# Altium schematic sheet MainBoard.SchDoc
size A3
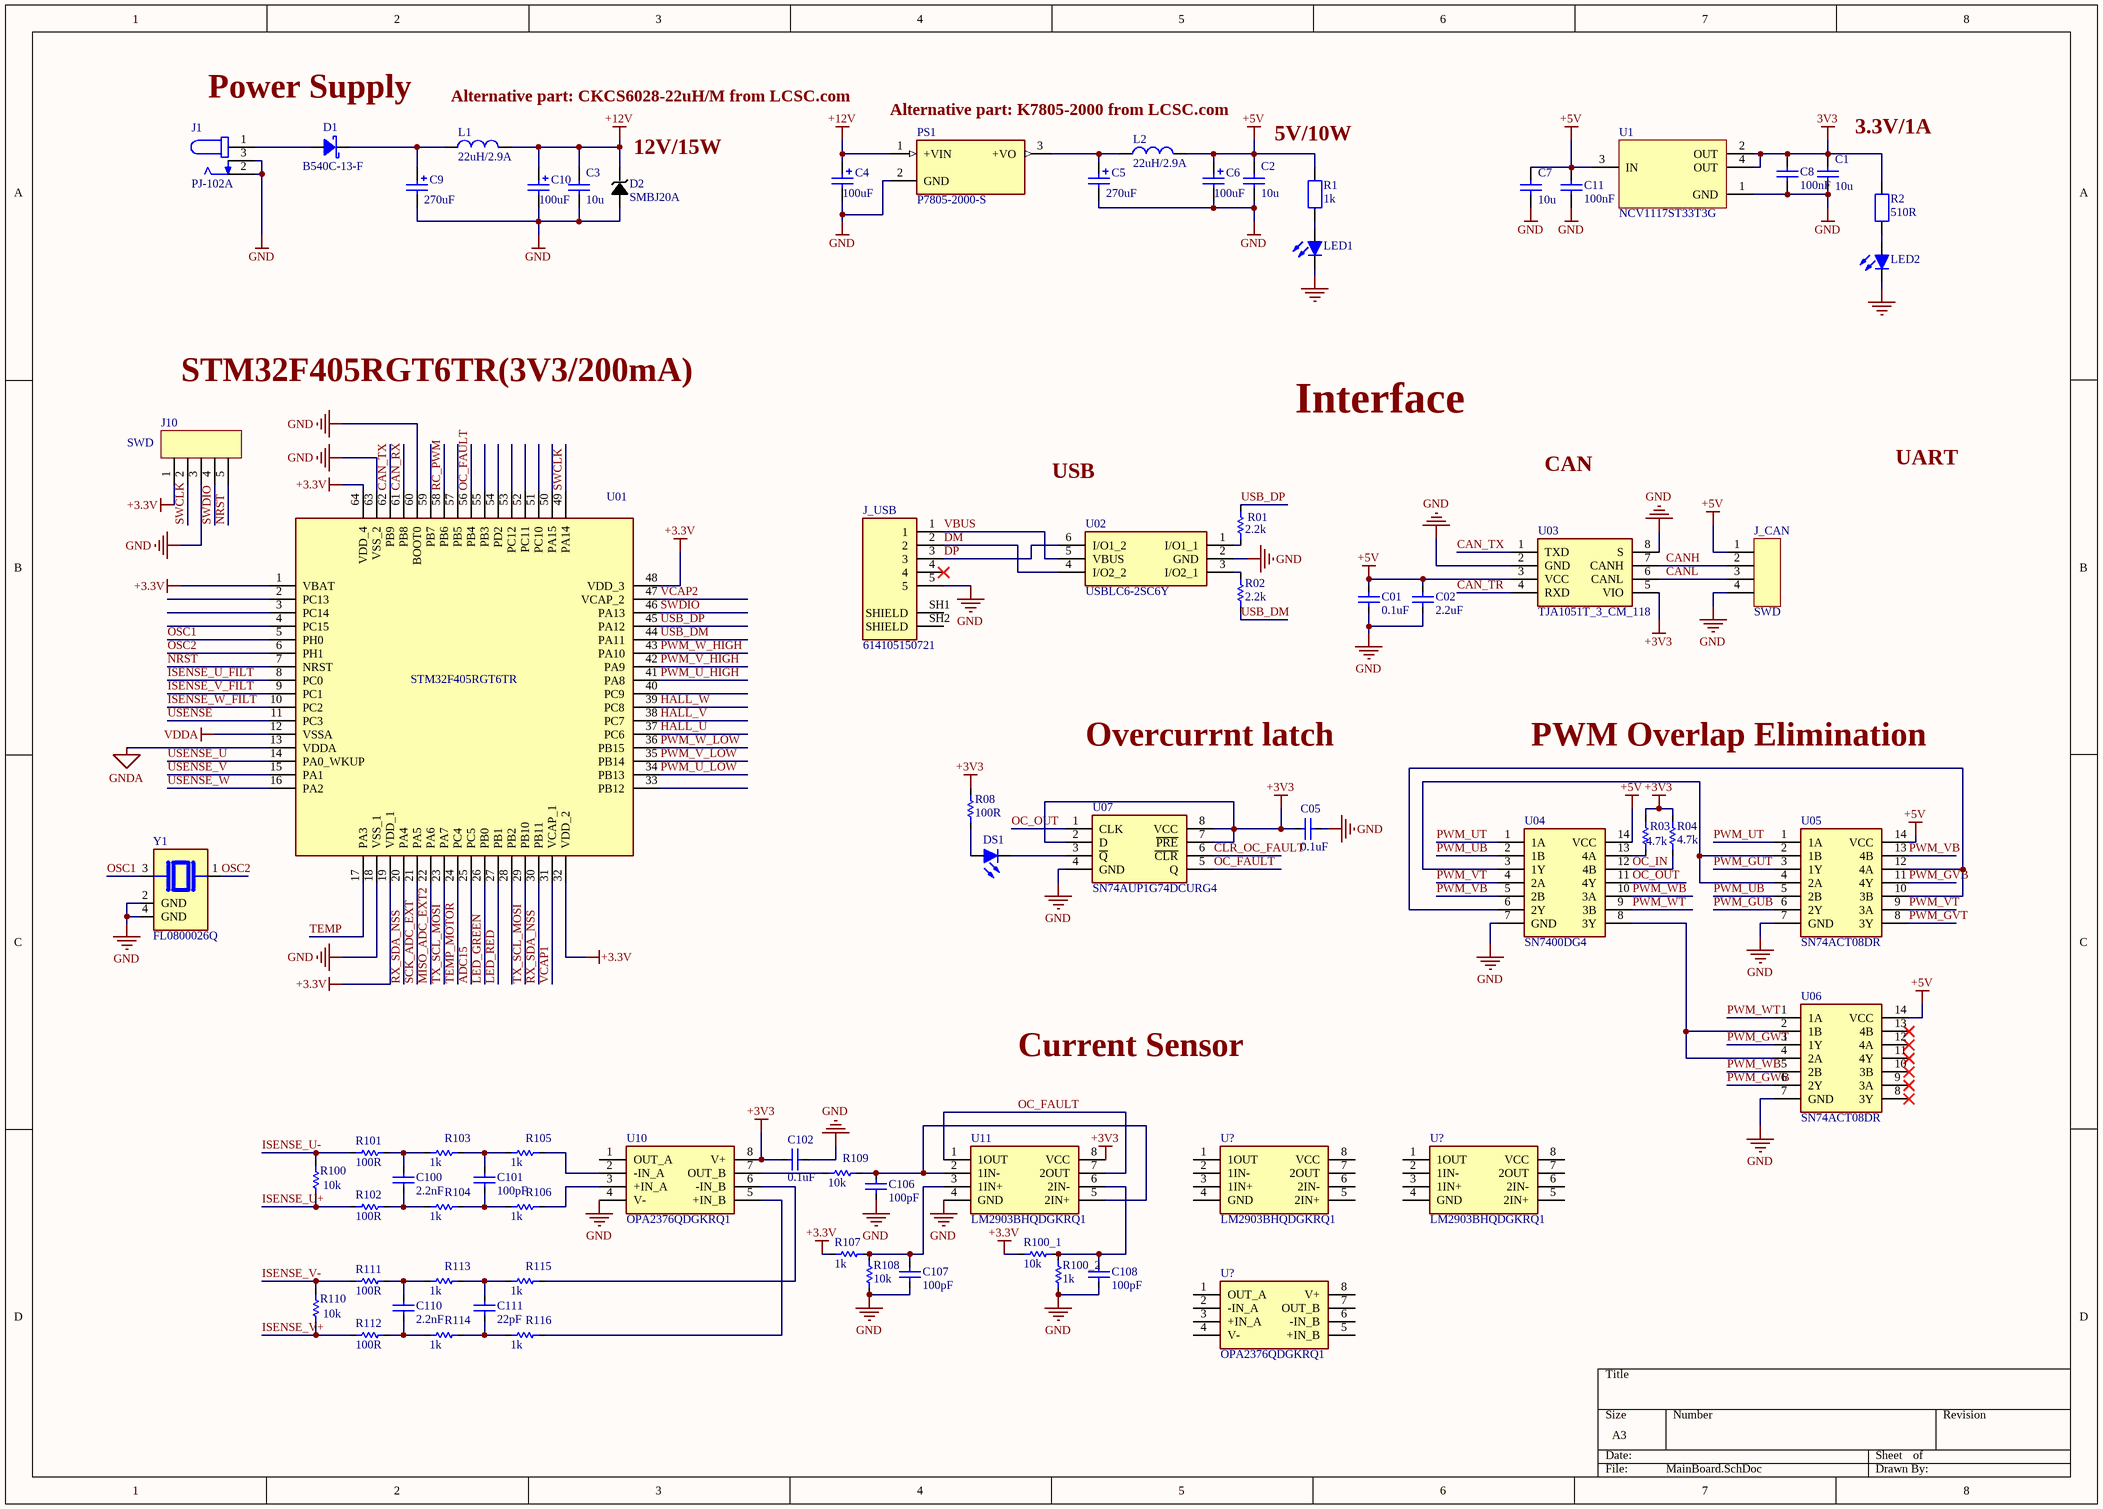
[diagram p0: MainBoard.SchDoc]

## Parts
(Parts that share a designator on the sheet are numbered #1, #2 ... from top to bottom, then left to right.)
C1  10u  [C1206]
C01  0.1uF  [SMD_C(0402)]
C2  10u  [C1206]
C02  2.2uF  [SMD_C(0603)]
C3  10u  [C1206]
C4  100uF  [CAP_EEUFC1E101S]
C5  270uF  [CAP_EEU-FK1E271B]
C05  0.1uF  [SMD_C(0402)]
C6  100uF  [CAP_EEUFC1E101S]
C7  10u  [C1206]
C8  100nF  [C0603]
C9  270uF  [CAP_EEU-FK1E271B]
C10  100uF  [CAP_EEUFC1E101S]
C11  100nF  [C0603]
C100  2.2nF  [SMD_C(0402)]
C101  100pF  [SMD_C(0402)]
C102  0.1uF  [SMD_C(0402)]
C106  100pF  [SMD_C(0402)]
C107  100pF  [SMD_C(0402)]
C108  100pF  [SMD_C(0402)]
C110  2.2nF  [SMD_C(0402)]
C111  22pF  [SMD_C(0402)]
D1  B540C-13-F  [DO-214AB2]
D2  SMBJ20A  [DO-214AA2]
DS1  SML-D12U1WT86  [LED0603]  (value not drawn)
J1  PJ-102A  [CUI_PJ-102A]
J10  SWD  [Header-2.54m-5pin]
J_CAN  SWD  [Header-2.54m-4pin]
J_USB  614105150721  [WURTH_614105150721]
L1  22uH/2.9A  [IND_SRP6030]
L2  22uH/2.9A  [IND_SRP6030]
LED1  SML-D12U1WT86  [LED0603]  (value not drawn)
LED2  SML-D12U1WT86  [LED0603]  (value not drawn)
PS1  P7805-2000-S  [CONV_P7805-2000-S]
R1  1k  [R0603]
R01  2.2k  [SMD_R(0402)]
R2  510R  [R0603]
R02  2.2k  [SMD_R(0402)]
R03  4.7k  [SMD_R(0402)]
R04  4.7k  [SMD_R(0402)]
R08  100R  [SMD_R(0402)]
R100  10k  [SMD_R(0402)]
R100_1  10k  [SMD_R(0402)]
R100_2  1k  [SMD_R(0402)]
R101  100R  [SMD_R(0402)]
R102  100R  [SMD_R(0402)]
R103  1k  [SMD_R(0402)]
R104  1k  [SMD_R(0402)]
R105  1k  [SMD_R(0402)]
R106  1k  [SMD_R(0402)]
R107  1k  [SMD_R(0402)]
R108  10k  [SMD_R(0402)]
R109  10k  [SMD_R(0402)]
R110  10k  [SMD_R(0402)]
R111  100R  [SMD_R(0402)]
R112  100R  [SMD_R(0402)]
R113  1k  [SMD_R(0402)]
R114  1k  [SMD_R(0402)]
R115  1k  [SMD_R(0402)]
R116  1k  [SMD_R(0402)]
U1  NCV1117ST33T3G  [SOT223-3]
U01  STM32F405RGT6TR  [QFP50P1200X1200X160-64N]
U02  USBLC6-2SC6Y  [SOT95P280X145-6N]
U03  TJA1051T_3_CM_118  [SOIC127P600X175-8N]
U04  SN7400DG4  [SOIC127P600X175-14N]
U05  SN74ACT08DR  [SOIC127P600X175-14N]
U06  SN74ACT08DR  [SOIC127P600X175-14N]
U07  SN74AUP1G74DCURG4  [SOP50P310X90-8N]
U10  OPA2376QDGKRQ1  [SOP65P490X110-8N]
U11  LM2903BHQDGKRQ1  [SOP65P490X110-8N]
U?#1  LM2903BHQDGKRQ1  [SOP65P490X110-8N]
U?#2  LM2903BHQDGKRQ1  [SOP65P490X110-8N]
U?#3  OPA2376QDGKRQ1  [SOP65P490X110-8N]
Y1  FL0800026Q  [XTAL_FL0800026Q]

## Nets
3V3: C1.2 C8.2 R2.2 U1.2(OUT) U1.4(OUT)
+3.3V: J10.1 R100_1.1 R107.1 U01.1(VBAT) U01.19(VDD_1) U01.32(VDD_2) U01.48(VDD_3) U01.64(VDD_4)
+3V3: C05.2 C102.1 R03.2 R04.2 R08.2 U03.5(VIO) U07.2(D) U07.7(~{PRE}) U07.8(VCC) U10.8(V+) U11.8(VCC)
+5V: C01.2 C2.2 C02.2 C6.1 C7.2 C11.2 J_CAN.1 L2.2 R1.2 U1.3(IN) U03.3(VCC) U04.14(VCC) U05.14(VCC) U06.14(VCC)
+12V: C3.2 C4.1 C10.1 D2.C L1.2 PS1.1(+VIN)
GND: C1.1 C01.1 C2.1 C02.1 C3.1 C4.2 C05.1 C5.2 C6.2 C7.1 C8.1 C9.2 C10.2 C11.1 C102.2 C106.1 C107.1 C108.1 D2.A J1.2 J1.3 J10.3 J_CAN.4 J_USB.5 LED1.C LED2.C PS1.2(GND) R100_2.2 R108.2 U1.1(GND) U01.18(VSS_1) U01.60(BOOT0) U01.63(VSS_2) U02.2(GND) U03.2(GND) U03.8(S) U04.7(GND) U05.7(GND) U06.7(GND) U07.4(GND) U10.4(V-) U11.4(GND) Y1.2(GND) Y1.4(GND)
GNDA: U01.13(VDDA)
VDDA: U01.12(VSSA)
ADC15: U01.25(PC5)
CAN_RX: U01.61(PB8)
CAN_TR: U03.4(RXD)
CAN_TX: U01.62(PB9) U03.1(TXD)
CANH: J_CAN.2 U03.7(CANH)
CANL: J_CAN.3 U03.6(CANL)
CLR_OC_FAULT: U07.6(~{CLR})
DM: J_USB.2 U02.4(I/O2_2)
DP: J_USB.3 U02.6(I/O1_2)
HALL_U: U01.37(PC6)
HALL_V: U01.38(PC7)
HALL_W: U01.39(PC8)
ISENSE_U+: R100.2 R102.2
ISENSE_U-: R100.1 R101.2
ISENSE_U_FILT: U01.8(PC0)
ISENSE_V+: R110.2 R112.2
ISENSE_V-: R110.1 R111.2
ISENSE_V_FILT: U01.9(PC1)
ISENSE_W_FILT: U01.10(PC2)
LED_GREEN: U01.26(PB0)
LED_RED: U01.27(PB1)
MISO_ADC_EXT2: U01.22(PA6)
NRST: J10.5 U01.7(NRST)
OC_FAULT: U01.56(PB4) U07.5(Q) U11.1(1OUT) U11.7(2OUT)
OC_IN: R04.1 U04.12(4B)
OC_OUT: U04.11(4Y) U07.1(CLK)
OSC1: U01.5(PH0) Y1.3
OSC2: U01.6(PH1) Y1.1
PWM_GUB: U05.6(2Y)
PWM_GUT: U05.3(1Y)
PWM_GVB: U05.11(4Y)
PWM_GVT: U05.8(3Y)
PWM_GWB: U06.6(2Y)
PWM_GWT: U06.3(1Y)
PWM_U_HIGH: U01.41(PA8)
PWM_U_LOW: U01.34(PB13)
PWM_UB: U04.2(1B) U05.5(2B)
PWM_UT: U04.1(1A) U05.1(1A)
PWM_V_HIGH: U01.42(PA9)
PWM_V_LOW: U01.35(PB14)
PWM_VB: U04.5(2B) U05.13(4B)
PWM_VT: U04.4(2A) U05.9(3A)
PWM_W_HIGH: U01.43(PA10)
PWM_W_LOW: U01.36(PB15)
PWM_WB: U04.10(3A) U06.5(2B)
PWM_WT: U04.9(3B) U06.1(1A)
RC_PWM: U01.58(PB6)
RX_SDA_NSS: U01.20(PA4) U01.30(PB11)
SCK_ADC_EXT: U01.21(PA5)
SWCLK: J10.2 U01.49(PA14)
SWDIO: J10.4 U01.46(PA13)
TEMP: U01.17(PA3)
TEMP_MOTOR: U01.24(PC4)
TX_SCL_MOSI: U01.23(PA7) U01.29(PB10)
USB_DM: R02.2 U01.44(PA11)
USB_DP: R01.2 U01.45(PA12)
USENSE: U01.11(PC3)
USENSE_U: U01.14(PA0_WKUP)
USENSE_V: U01.15(PA1)
USENSE_W: U01.16(PA2)
VBUS: J_USB.1 U02.5(VBUS)
VCAP1: U01.31(VCAP_1)
VCAP2: U01.47(VCAP_2)
NetC5_1: C5.1 L2.1 PS1.3(+VO)
NetC9_1: C9.1 D1.C L1.1
NetC100_1: C100.1 R102.1 R104.2
NetC100_2: C100.2 R101.1 R103.2
NetC101_1: C101.1 R104.1 R106.2
NetC101_2: C101.2 R103.1 R105.2
NetC106_2: C106.2 R109.1 U11.2(1IN-) U11.5(2IN+)
NetC107_2: C107.2 R107.2 R108.1 U11.3(1IN+)
NetC108_2: C108.2 R100_1.2 R100_2.1 U11.6(2IN-)
NetC110_1: C110.1 R112.1 R114.2
NetC110_2: C110.2 R111.1 R113.2
NetC111_1: C111.1 R114.1 R116.2
NetC111_2: C111.2 R113.1 R115.2
NetD1_A: D1.A J1.1
NetDS1_A: DS1.A R08.1
NetDS1_C: DS1.C U07.3(~{Q})
NetLED1_A: LED1.A R1.1
NetLED2_A: LED2.A R2.1
NetR01_1: R01.1 U02.1(I/O1_1)
NetR02_1: R02.1 U02.3(I/O2_1)
NetR03_1: R03.1 U04.13(4A)
NetR105_1: R105.1 U10.2(-IN_A)
NetR106_1: R106.1 U10.3(+IN_A)
NetR109_2: R109.2 U10.7(OUT_B)
NetR115_1: R115.1 U10.6(-IN_B)
NetR116_1: R116.1 U10.5(+IN_B)
NetU04_3: U04.3(1Y) U05.2(1B) U05.4(2A)
NetU04_6: U04.6(2Y) U05.10(3B) U05.12(4A)
NetU04_8: U04.8(3Y) U06.2(1B) U06.4(2A)

Not connected (* = marked no-connect by the designer): J_USB 4* SH1(SHIELD) SH2(SHIELD); U01 2(PC13) 3(PC14) 4(PC15) 28(PB2) 33(PB12) 40(PC9) 50(PA15) 51(PC10) 52(PC11) 53(PC12) 54(PD2) 55(PB3) 57(PB5) 59(PB7); U06 8(3Y)* 9(3A)* 10(3B)* 11(4Y)* 12(4A)* 13(4B)*; U10 1(OUT_A); U?#1 1(1OUT) 2(1IN-) 3(1IN+) 4(GND) 5(2IN+) 6(2IN-) 7(2OUT) 8(VCC); U?#2 1(1OUT) 2(1IN-) 3(1IN+) 4(GND) 5(2IN+) 6(2IN-) 7(2OUT) 8(VCC); U?#3 1(OUT_A) 2(-IN_A) 3(+IN_A) 4(V-) 5(+IN_B) 6(-IN_B) 7(OUT_B) 8(V+)

## Notes on the sheet
- Power Supply
- (near L1) Alternative part: CKCS6028-22uH/M from LCSC.com
- (near D2) 12V/15W
- Alternative part: K7805-2000 from LCSC.com
- 5V/10W
- 3.3V/1A
- STM32F405RGT6TR(3V3/200mA)
- Interface
- USB
- CAN
- UART
- Overcurrnt latch
- PWM Overlap Elimination
- Current Sensor

## Library data of the parts
C1-C3 C7 = 10uF ± 10% 25V: Manufacturer: Yageo; Manufacturer Part Number: CC1206KKX7R8BB106; Tolerance: +-10%; Type: X7R; Voltage (V): 25; Category: Capacitor; Value: 10u; Price: 0.44; Supplier: Mouser; Supplier Part Number: 603-CC126KKX7R8BB106
C01 C05 C102 = Cap_1: Multilayer Ceramic Capacitors MLCC - SMD/SMT 50 V 0.1uF X7R 0603 10%; Manufacturer: Yageo; Manufacturer Part Number: CC0603KPX7R9BB104; Supplier 1: Digi-Key; Supplier Part Number 1: 311-3567-1-ND
C02 = Cap_4: Multilayer Ceramic Capacitors MLCC - SMD/SMT 2.2 uF 50 VDC 10% 1206 X7R AEC-Q200; Manufacturer: Yageo; Manufacturer Part Number: GCM31CR71H225KA55K; Supplier 1: Digi-Key; Supplier Part Number 1: 311-3567-1-ND
C4 C6 C10 = EEU-FC1E101S: CAP ALUM 100UF 20% 25V SMD; Manufacturer: Panasonic; Manufacturer Part Number: EEU-FC1E101S; Value: 100uF; Supplier: Mouser; Supplier Part Number: 667-EEU-FC1E101S; Price: 0.4
C5 C9 = EEU-FC1E271B: CAP ALUM 270UF 20% 25V SMD; Manufacturer: Panasonic; Manufacturer Part Number: EEU-FC1E271B; Value: 270uF; Supplier: Mouser; Supplier Part Number: 667-EEU-FC1E271B; Price: 0.7
C8 C11 = 100nF ± 10% 50V: Manufacturer: Yageo; Manufacturer Part Number: CC0603KRX7R9BB104; Value: 100nF; Supplier: Mouser; Supplier Part Number: 603-CC603KRX7R9BB104; Price: 0.1
C100 C101 C106-C108 C110 C111 = Cap_7: PHE840MA6100MA04R17; Manufacturer: Yageo; Manufacturer Part Number: CC0603KPX7R9BB104; Supplier 1: Digi-Key; Supplier Part Number 1: 311-3567-1-ND
D1 = B540C-13-F: Schottky Diodes & Rectifiers 40V 5A; Value: B540C-13-F; Manufacturer Part Number: B540C-13-F; Manufacturer: Diodes; Supplier: Mouser; Supplier Part Number: 621-B540C-F; Price: 0.5
D2 = ZM4746A-GS08: ESD Suppressors / TVS Diodes 600W, 23.4V, 5%, Unidirectional, TVS; Manufacturer: Littelfuse; Value: SMBJ20A; Manufacturer Part Number: SMBJ20A; Supplier: Mouser; Supplier Part Number: 576-SMBJ20A; Price: 0.35
DS1 LED1 LED2 = SML-D12U1WT86: Typical RED GaAs LED; Manufacturer: Rohm Semiconductor; Supplier: Mouser; Supplier Part Number: 755-SML-D12U1WT86; Manufacturer Part Number: SML-D12U1WT86; Value: SML-D12U1WT86; Price: 0.2
J1 = PJ-102A: CONN PWR JACK 2X5.5MM SOLDER; Manufacturer: CUI Devices; Manufacturer Part Number: PJ-102A; Value: PJ-102A; Supplier: Mouser; Supplier Part Number: 490-PJ-102A; Price: 0.8
J10 = 5PinConnector
J_CAN = 4PinConnector
J_USB = 614105150721: USB - micro B USB 2.0 Receptacle Connector 5 Position Through Hole; MF: Wurth Electronics; Package: None; Digi-Key_Part_Number: 732-5958-1-ND; MP: 614105150721; SnapEDA_Link: https://www.snapeda.com/parts/614105150721/Wurth%20Electronics%20Inc./view-part/1118291/?ref=snap; Value: *; Digi-Key_Purchase_URL: https://www.digikey.com/product-detail/en/w-rth-elektronik/614105150721/732-5958-1-ND/5047553?utm_source=snapeda&utm_medium=aggregator&utm_campaign=symbol
L1 L2 = SRP6030WA-220M: Power Inductors - SMD Ind,7.1x6.6x2.8mm,22uH+/-20%,2.9A,shd; Manufacturer: Bourns; Manufacturer Part Number: SRP6030WA-220M; Value: 22uH/2.9A; Supplier: Mouser; Supplier Part Number: 652-SRP6030WA-220M; Price: 1.2
PS1 = P7805-2000-S: 2 A Output Current, 6~36 Vdc Input, SIP, Non-Isolated, Dc-Dc Converter; Manufacturer: CUI Inc.; Price: 6.5; Supplier: Mouser; Value: P7805-2000-S; Supplier Part Number: 490-P7805-2000-S; Manufacturer Part Number: P7805-2000-S
R1 = 1 kOhms ±1% 0.1W: Manufacturer: Yageo; Manufacturer Part Number: RC0603FR-071KL; Value: 1k; Supplier: Mouser; Supplier Part Number: 603-RC0603FR-071KL; Price: 0.1
R01 R02 = Res Semi_2: CRCW04024R02FKED; Published: 8-Jun-2000; LatestRevisionDate: 17-Jul-2002; LatestRevisionNote: Re-released for DXP Platform.; PackageReference: AXIAL-0.5; Publisher: Altium Limited; PackageDescription: Axial Device, Thru-Hole; 2 Leads; 0.5 in Pin Spacing
R2 = 510 Ohm ±1% 0.1W: Manufacturer: Yageo; Manufacturer Part Number: RC0603FR-07510RL; Value: 510R; Supplier: Mouser; Supplier Part Number: 603-RC0603FR-07510RL; Price: 0.1
R03 R04 = Res Semi_3: CRCW04024R02FKED; Published: 8-Jun-2000; LatestRevisionDate: 17-Jul-2002; LatestRevisionNote: Re-released for DXP Platform.; PackageReference: AXIAL-0.5; Publisher: Altium Limited; PackageDescription: Axial Device, Thru-Hole; 2 Leads; 0.5 in Pin Spacing
R08 R100 R100_1 R100_2 R101-R116 = Res Semi_1: CRCW04024R02FKED; Published: 8-Jun-2000; LatestRevisionDate: 17-Jul-2002; LatestRevisionNote: Re-released for DXP Platform.; PackageReference: AXIAL-0.5; Publisher: Altium Limited; PackageDescription: Axial Device, Thru-Hole; 2 Leads; 0.5 in Pin Spacing
U1 = NCV1117ST33T3G: LDO Voltage Regulators 3.3V 1.0A Automotive; Manufacturer: onsemi; Price: 0.7; Manufacturer Part Number: NCV1117ST33T3G; Supplier Part Number: 863-NCV1117ST33T3G; Value: NCV1117ST33T3G; Supplier: Mouser
U01 = STM32F405RGT6TR: STM32F405RGT6TR, 32 bit ARM Cortex M4 MCU 168MHz 1024 kB Flash, 192 kB RAM, 2xUSB CAN I2C 64-Pin LQFP; Manufacturer_Name: STMicroelectronics; Geometry.Height: 1.6mm; Mouser Part Number: 511-STM32F405RGT6TR; Mouser Price/Stock: https://www.mouser.co.uk/ProductDetail/STMicroelectronics/STM32F405RGT6TR?qs=MavH1QghrkHshpR6GkvPIg%3D%3D; Manufacturer_Part_Number: STM32F405RGT6TR; Datasheet Link: http://www.st.com/web/en/resource/technical/document/datasheet/DM00037051.pdf
U02 = USBLC6-2SC6Y: Low Cap. ESD Protection Auto SOT-23-6 STMicroelectronics USBLC6-2SC6Y, Dual Uni-Directional TVS Diode Array, 6-Pin SOT-23; Geometry.Height: 1.45mm; Mouser Part Number: 511-USBLC6-2SC6Y; Mouser Price/Stock: https://www.mouser.co.uk/ProductDetail/STMicroelectronics/USBLC6-2SC6Y?qs=gNDSiZmRJS%2FOgDexvXkdow%3D%3D; Manufacturer_Name: STMicroelectronics; Manufacturer_Part_Number: USBLC6-2SC6Y; Datasheet Link: https://componentsearchengine.com/Datasheets/1/USBLC6-2SC6Y.pdf
U03 = TJA1051T_3_CM_118: CAN Interface IC BL Advanced Automotive Analog; Manufacturer_Name: NXP; Manufacturer_Part_Number: TJA1051T/3/CM,118; Geometry.Height: 1.75mm; Mouser Part Number: 771-TJA1051T/3CM118; Mouser Price/Stock: https://www.mouser.co.uk/ProductDetail/NXP-Semiconductors/TJA1051T-3-CM118?qs=5XOdhvmYM0NUkmo%252BpXvJfw%3D%3D; Datasheet Link: http://www.nxp.com/docs/en/data-sheet/TJA1051.pdf
U04 = SN7400DG4: NAND Gate 4-Element 2-IN Bipolar 14-Pin SOIC Tube; Manufacturer_Name: Texas Instruments; Geometry.Height: 1.75mm; Mouser Part Number: 595-SN7400DG4; Mouser Price/Stock: https://www.mouser.co.uk/ProductDetail/Texas-Instruments/SN7400DG4?qs=E8lYj0tdJGGtKkNRXTqCCA%3D%3D; Manufacturer_Part_Number: SN7400DG4; Datasheet Link: https://www.arrow.com/en/products/sn7400dg4/texas-instruments
U05 U06 = SN74ACT08DR: Texas Instruments SN74ACT08DR, AND Quad 2 Input AND, 4.5  5.5 V, 14-Pin SOIC; Geometry.Height: 1.75mm; Mouser Part Number: 595-SN74ACT08DR; Mouser Price/Stock: https://www.mouser.co.uk/ProductDetail/Texas-Instruments/SN74ACT08DR?qs=AMJt07B76uu%2FkRdXJtIwhw%3D%3D; Manufacturer_Name: Texas Instruments; Manufacturer_Part_Number: SN74ACT08DR; Datasheet Link: http://www.ti.com/lit/gpn/sn74act08
U07 = SN74AUP1G74DCURG4: Flip Flops Lo PWR SNGL Pos Edge Trgrd DType FlipFlop; Manufacturer_Name: Texas Instruments; Geometry.Height: 0.9mm; Mouser Part Number: 595-74AUP1G74DCURG4; Mouser Price/Stock: https://www.mouser.co.uk/ProductDetail/Texas-Instruments/SN74AUP1G74DCURG4?qs=7kv20MEVUlhYDCdFtbMd%2FA%3D%3D; Manufacturer_Part_Number: SN74AUP1G74DCURG4; Datasheet Link: *
U10 U?#3 = OPA2376QDGKRQ1: Low Noise, Low Quiescent Current, Precision Operational Amplifier e-trim/trade; Manufacturer_Name: Texas Instruments; Geometry.Height: 1.1mm; Mouser Part Number: 595-OPA2376QDGKRQ1; Mouser Price/Stock: https://www.mouser.co.uk/ProductDetail/Texas-Instruments/OPA2376QDGKRQ1?qs=zEmsApcVOkU338m46%2F1O7A%3D%3D; Manufacturer_Part_Number: OPA2376QDGKRQ1; Datasheet Link: http://www.ti.com/lit/gpn/opa2376-q1
U11 U?#1 U?#2 = LM2903BHQDGKRQ1: Analog Comparators Automotive, dual, differential, commodity comparator; Manufacturer_Name: Texas Instruments; Geometry.Height: 1.1mm; Mouser Part Number: 595-LM2903BHQDGKRQ1; Mouser Price/Stock: https://www.mouser.co.uk/ProductDetail/Texas-Instruments/LM2903BHQDGKRQ1?qs=By6Nw2ByBD2mW87GUmotXw%3D%3D; Manufacturer_Part_Number: LM2903BHQDGKRQ1; Datasheet Link: https://www.ti.com/lit/ds/symlink/lm2903b-q1.pdf?HQS=dis-mous-null-mousermode-dsf-pf-null-wwe&ts=1670767488652&ref_url=https%253A%252F%252Fwww.mouser.de%252F
Y1 = FL0800026Q: 8 MHz Â±30ppm Crystal 8pF 400 Ohms 4-SMD, No Lead; MF: Diodes Incorporated; Package: NON STANDARD-4 Diodes Inc.; Price: None; Check_prices: https://www.snapeda.com/parts/FL0800026Q/Diodes+Inc./view-part/?ref=eda; Value: *; SnapEDA_Link: https://www.snapeda.com/parts/FL0800026Q/Diodes+Inc./view-part/?ref=snap; MP: FL0800026Q; Availability: In Stock; Purchase-URL: https://pricing.snapeda.com/search?q=FL0800026Q&ref=eda